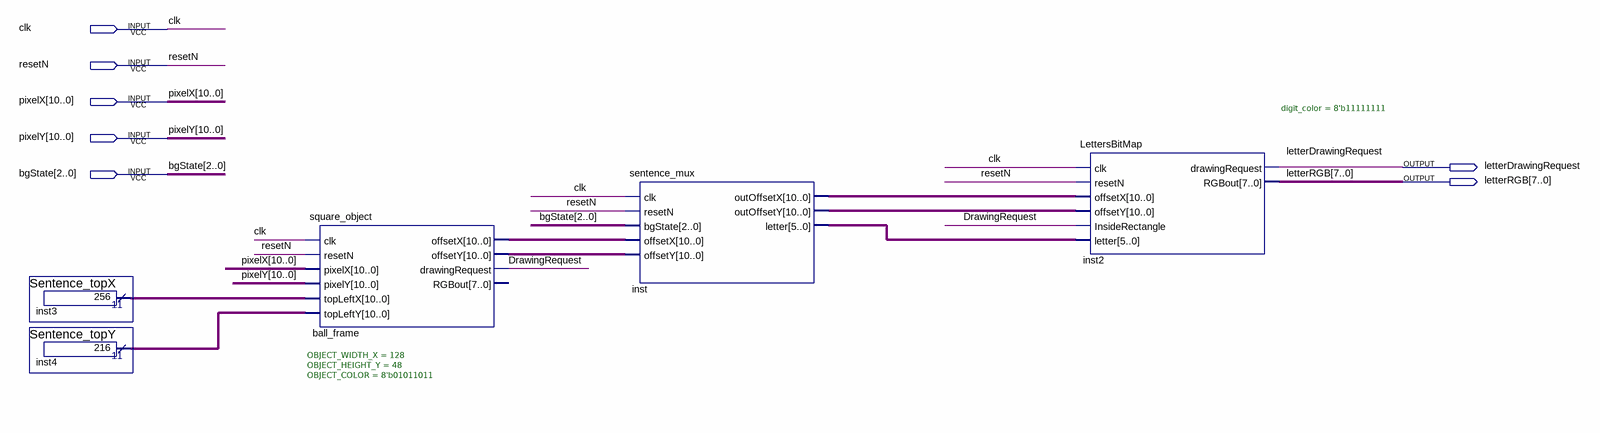
[diagram p0: schematic sheet]
// Quartus schematic sentence_print.bdf as structural Verilog: 5 symbols, 7 pins
module sentence_print (
  input  clk,
  input  resetN,
  input  [10:0] pixelX,
  input  [10:0] pixelY,
  input  [2:0] bgState,
  output letterDrawingRequest,
  output [7:0] letterRGB
);

  wire DrawingRequest;
  wire [5:0] inst_letter;
  wire [10:0] ball_frame_offsetx, ball_frame_offsety, inst3_result, inst4_result, inst_outoffsetx,
       inst_outoffsety;

  Sentence_topX inst3 (.result(inst3_result));
  Sentence_topY inst4 (.result(inst4_result));
  square_object #(.OBJECT_WIDTH_X(128), .OBJECT_HEIGHT_Y(48), .OBJECT_COLOR(8'b01011011)) ball_frame (
    .clk(clk), .resetN(resetN), .pixelX(pixelX), .pixelY(pixelY), .topLeftX(inst3_result),
    .topLeftY(inst4_result), .offsetX(ball_frame_offsetx), .offsetY(ball_frame_offsety),
    .drawingRequest(DrawingRequest));  // open: RGBout
  sentence_mux inst (
    .clk(clk), .resetN(resetN), .bgState(bgState), .offsetX(ball_frame_offsetx),
    .offsetY(ball_frame_offsety), .outOffsetX(inst_outoffsetx), .outOffsetY(inst_outoffsety),
    .letter(inst_letter));
  LettersBitMap #(.digit_color(8'b11111111)) inst2 (
    .clk(clk), .resetN(resetN), .offsetX(inst_outoffsetx), .offsetY(inst_outoffsety),
    .InsideRectangle(DrawingRequest), .letter(inst_letter), .drawingRequest(letterDrawingRequest),
    .RGBout(letterRGB));
endmodule
